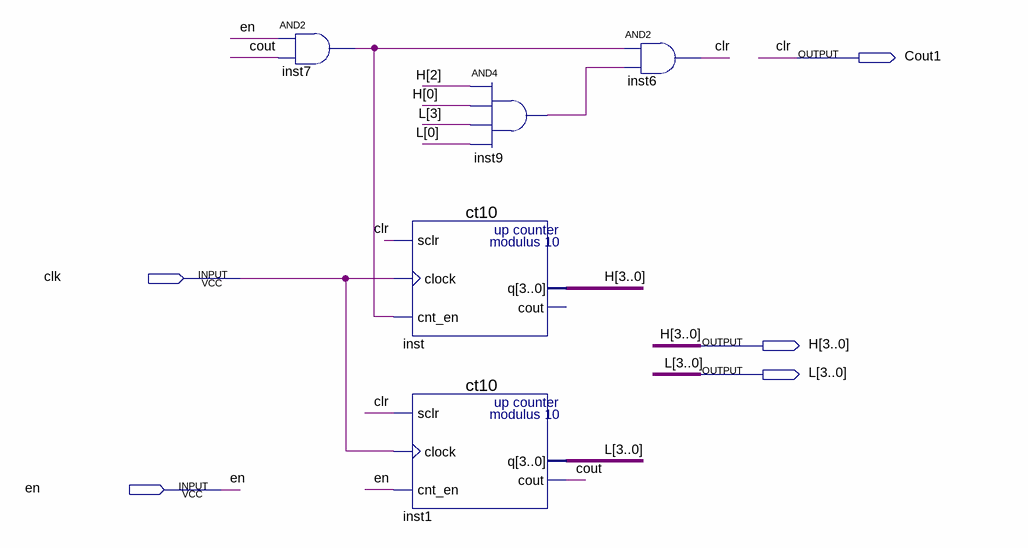
[diagram p0: schematic sheet]
// Quartus schematic block60.bdf as structural Verilog: 5 symbols, 5 pins
module block60 (
  input  clk,
  input  en,
  output Cout1,
  output [3:0] H,
  output [3:0] L
);

  wire cout, inst7_out, inst9_out;

  and inst7 (inst7_out, en, cout);
  ct10 inst (.sclr(Cout1), .clock(clk), .cnt_en(inst7_out), .q(H));  // open: cout
  ct10 inst1 (.sclr(Cout1), .clock(clk), .cnt_en(en), .q(L), .cout(cout));
  and inst9 (inst9_out, H[2], H[0], L[3], L[0]);
  and inst6 (Cout1, inst7_out, inst9_out);

  // Other names for the same wires on the sheet: clr = Cout1
endmodule
